# Altium schematic sheet 11-ANALOG.SchDoc
size A4
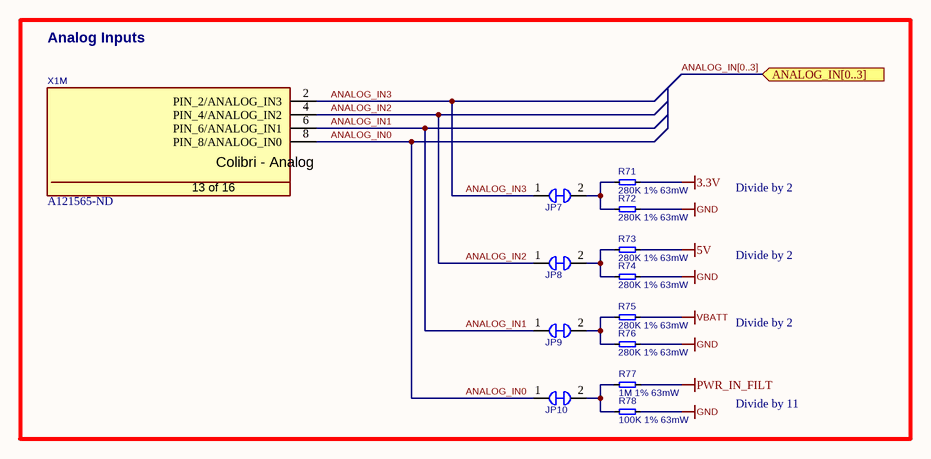
[diagram p0: 11-ANALOG.SchDoc]

## Parts
JP7  Jumper NC SMD  [NC]  (value not drawn)  (net tie, no BOM)
JP8  Jumper NC SMD  [NC]  (value not drawn)  (net tie, no BOM)
JP9  Jumper NC SMD  [NC]  (value not drawn)  (net tie, no BOM)
JP10  Jumper NC SMD  [NC]  (value not drawn)  (net tie, no BOM)
R71  280K 1% 63mW  [RESC1005X40N]
R72  280K 1% 63mW  [RESC1005X40N]
R73  280K 1% 63mW  [RESC1005X40N]
R74  280K 1% 63mW  [RESC1005X40N]
R75  280K 1% 63mW  [RESC1005X40N]
R76  280K 1% 63mW  [RESC1005X40N]
R77  1M 1% 63mW  [RESC1005X40N]
R78  100K 1% 63mW  [RESC1005X40N]
X1  Supplier Part Number 1: A121565-ND  [T_Tyco_1473005-1]  (hidden comment: 1473005-1)  (part M of 16)

## Ports
ANALOG_IN[0..3] (in)

## Nets
3.3V: R71.2
5V: R73.2
GND: R72.2 R74.2 R76.2 R78.1
PWR_IN_FILT: R77.1
VBATT: R75.2
ANALOG_IN0: JP10.1 X1.8(PIN_8/ANALOG_IN0)
ANALOG_IN1: JP9.1 X1.6(PIN_6/ANALOG_IN1)
ANALOG_IN2: JP8.1 X1.4(PIN_4/ANALOG_IN2)
ANALOG_IN3: JP7.1 X1.2(PIN_2/ANALOG_IN3)
NetJP7_2: JP7.2 R71.1 R72.1
NetJP8_2: JP8.2 R73.1 R74.1
NetJP9_2: JP9.2 R75.1 R76.1
NetJP10_2: JP10.2 R77.2 R78.2

## Buses and harness runs
bus ANALOG_IN[0..3] = port ANALOG_IN[0..3]

## Notes on the sheet
- Analog Inputs
- Divide by 2
- Divide by 11
- (in symbol CON-Tyco-1473005-1-200-0.6mm, part M) Colibri - Analog; 13 of 16

## Library data of the parts
JP7-JP10 = Jumper NC SMD: SMD jumper normally closed; Footprint Checked: -; Symbol Checked: -
R71-R76 = R-280K-1%-0402: Resistor 280Kohm 63mW 1% 0402; MFG: <GENERIC>; Power: 63mW; Tolerance: 1%; Footprint: R0402; Value: 280k; Supplier 1: Digi-Key; Supplier Part Number 1: 541-280KLCT-ND; Footprint Checked: -; Symbol Checked: -; MFG_PN: <GENERIC>
R77 = R-1M-1%-0402: Resistor 1Mohm 63mW 1% 0402; Manufacturer: <GENERIC>; Replacement Allowed: Yes; Power: 63mW; Tolerance: 1%; Footprint: R0402; Value: 1M; Supplier 1: Digi-Key; Supplier Part Number 1: 541-1.00MLCT-ND; Manufacturer Part Number: <GENERIC>
R78 = R-100K-1%-0402: Resistor 100Kohm 63mW 1% 0402; Manufacturer: <GENERIC>; Replacement Allowed: Yes; Power: 63mW; Tolerance: 1%; Value: 100k; Footprint: R0402; Supplier 1: Digi-Key; Supplier Part Number 1: 541-100KLCT-ND; Manufacturer Part Number: <GENERIC>
X1 = CON-Tyco-1473005-1-200-0.6mm: SODIMM Connector; Manufacturer Name: Tyco; No. of ways: 200; Supplier 1: Digi-Key; Manufacturer Part No.: 1473005-1